# Altium schematic sheet current_source.SchDoc
size A4; SheetNumber: 3; SheetTotal: 6
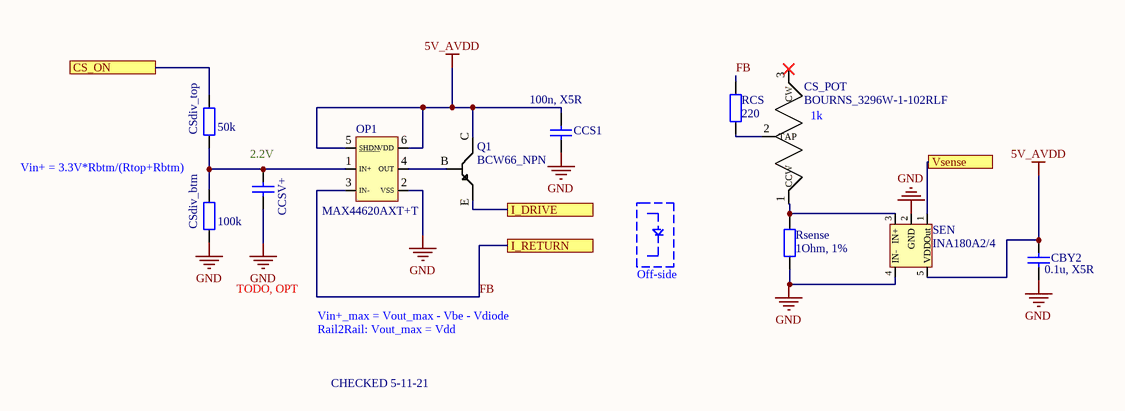
[diagram p0: current_source.SchDoc]

## Parts
CBY2  value 0.1u, X5R  [1608[0603]]
CCS1  value 100n, X5R  [1608[0603]]
CCSV+  value TODO, OPT  [1608[0603]]
CS_POT  BOURNS_3296W-1-102RLF  [BOURNS_3296W-1]
CSdiv_btm  100k  [WRIS-KSKE_0805]
CSdiv_top  50k  [WRIS-KSKE_0805]
OP1  MAX44620AXT+T  [MAX44260_ATX+T]
Q1  BCW66_NPN  [BCW66_NPN]
RCS  220  [WRIS-KSKE_0805]
Rsense  1Ohm, 1%  [WRIS-KSKE_0603]
SEN  INA180A2/4  [INA180Ax]

## Ports
CS_ON, I_DRIVE, I_RETURN, Vsense

## Nets
5V_AVDD: CBY2.1 CCS1.2 OP1.5(SHDN) OP1.6(VDD) Q1.C SEN.5(VDD)
GND: CBY2.2 CCS1.1 CCSV+.2 CSdiv_btm.2 OP1.2(VSS) Rsense.1 SEN.2(GND) SEN.4(IN-)
CS_ON: CSdiv_top.1 ; port CS_ON
FB: OP1.3(IN-) RCS.1 ; port I_RETURN
I_DRIVE: Q1.E ; port I_DRIVE
Vsense: SEN.1(Out) ; port Vsense
NetCCSV+_1: CCSV+.1 CSdiv_btm.1 CSdiv_top.2 OP1.1(IN+)
NetCS_POT_1: CS_POT.1(CCW) Rsense.2 SEN.3(IN+)
NetCS_POT_2: CS_POT.2(TAP) RCS.2
NetOP1_4: OP1.4(OUT) Q1.B

Not connected (* = marked no-connect by the designer): CS_POT 3(CW)*

## Notes on the sheet
- Vin+ = 3.3V*Rbtm/(Rtop+Rbtm)
- (near CCSV+) 2.2V
- (near CS_POT) 1k
- Off-side
- Vin+_max = Vout_max - Vbe - Vdiode
- Rail2Rail: Vout_max = Vdd
- CHECKED 5-11-21

## Library data of the parts
CBY2 CCS1 CCSV+ = Cap Semi: Capacitor (Semiconductor SIM Model); Published: 8-Jun-2000; LatestRevisionDate: 29-May-2009; LatestRevisionNote: IPC-7351 Footprint Added.; PackageReference: C1206; Publisher: Altium Limited; PackageDescription: Chip Capacitor
CS_POT = BOURNS_3296W-1-104RLF: Vertical Potentiometer, multi-turn, 10%
CSdiv_btm CSdiv_top RCS = 560050320001: WRIS-KSKE SMT Thick Film Resistor, size 0805, 0.1Ohm, 0.33W; Manufacturer: Wurth Elektronik; Rated Current: 1.81A; Temperature Coefficient of Resistance: 250ppm/degC; Technical Reference: KE0805R100F103LAATP0000; Resistance Tolerance: +/-1%; ComponentLink1Description: Manufacturer; ComponentLink1URL: http://www.we-online.de; ComponentLink2Description: Datasheet; ComponentLink2URL: https://www.we-online.com/catalog/datasheet/560050320001.pdf; Published Date: May 2020; Rated Power: 0.33W; Resistance: 0.1Ohm; Height: 0.6mm; Operating Temperature: -55 to +155degC; Mounting Technology: SMT; Packaging: Tape and Reel; Size: 0805; Length: 2mm; Manufacturer Part Number: 560050320001; Width: 1.25mm
OP1 = MAX44620AXT+T: Operationsverstärker 1.8V, 15MHz Low-Offs et, Low-Power, Rail
Rsense = 560050316001: WRIS-KSKE SMT Thick Film Resistor, size 0603, 0.1Ohm, 0.25W; Manufacturer: Wurth Elektronik; Rated Current: 1.58A; Temperature Coefficient of Resistance: 250ppm/degC; Technical Reference: KE0603R100F104LAATP0000; Resistance Tolerance: +/-1%; ComponentLink1Description: Manufacturer; ComponentLink1URL: http://www.we-online.de; ComponentLink2Description: Datasheet; ComponentLink2URL: https://www.we-online.com/catalog/datasheet/560050316001.pdf; Published Date: May 2020; Rated Power: 0.25W; Resistance: 0.1Ohm; Height: 0.45mm; Operating Temperature: -55 to +155degC; Mounting Technology: SMT; Packaging: Tape and Reel; Size: 0603; Length: 1.6mm; Manufacturer Part Number: 560050316001; Width: 0.8mm
SEN = INA180Ax: INA180Ax Low- and High-SideVoltageOutput,Current-SenseAmplifiers